# Altium schematic sheet power_supply.SchDoc: power supply
size 420 x 297 mm; SheetNumber: 6; SheetTotal: 8
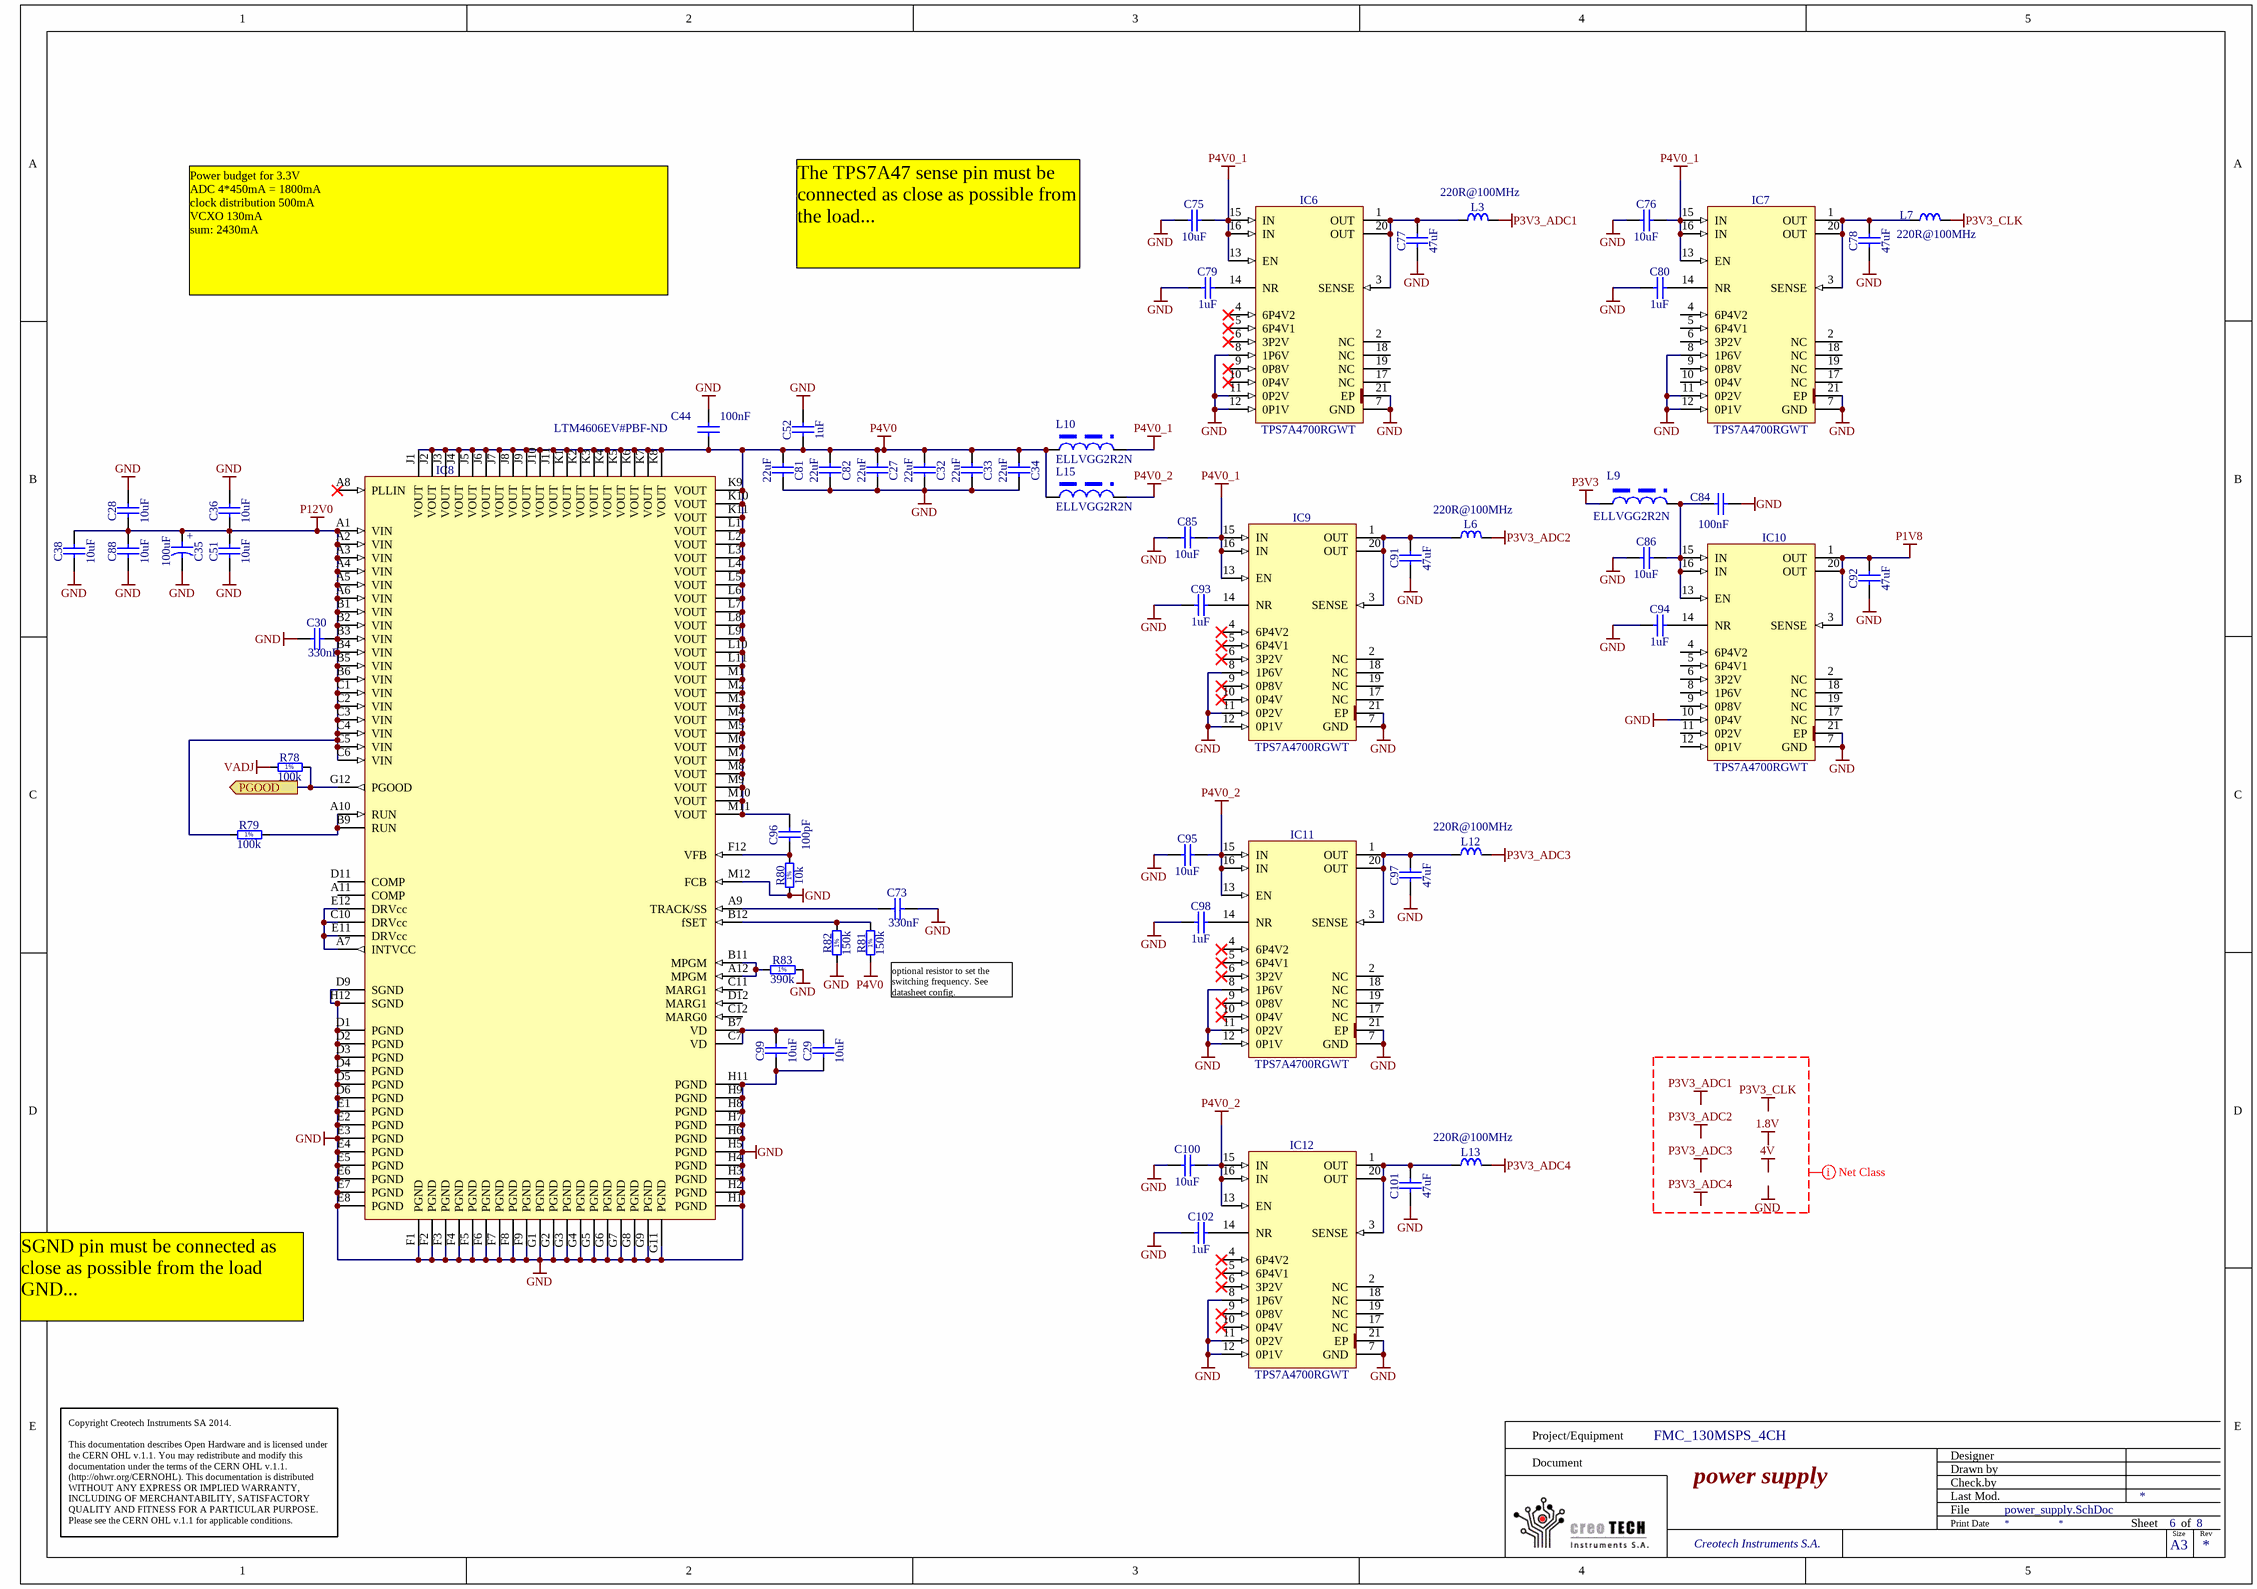
[diagram p0: power_supply.SchDoc]

## Parts
C27  22uF  [CAPC3216X140N]
C28  10uF  [CAPC2012X135N]
C29  10uF  [CAPC2012X135N]
C30  330nF  [CAPC1608X87N]
C32  22uF  [CAPC3216X140N]
C33  22uF  [CAPC3216X140N]
C34  22uF  [CAPC3216X140N]
C35  100uF  [CAPMP7343X310N]
C36  10uF  [CAPC2012X135N]
C38  10uF  [CAPC2012X135N]
C44  100nF  [CAPC0603X33N]
C51  10uF  [CAPC2012X135N]
C52  1uF  [CAPC1608X87N]
C73  330nF  [CAPC1608X87N]
C75  10uF  [CAPC2012X135N]
C76  10uF  [CAPC2012X135N]
C77  47uF  [CAPC2012X140N]
C78  47uF  [CAPC2012X140N]
C79  1uF  [CAPC1608X87N]
C80  1uF  [CAPC1608X87N]
C81  22uF  [CAPC3216X140N]
C82  22uF  [CAPC3216X140N]
C84  100nF  [CAPC0603X33N]
C85  10uF  [CAPC2012X135N]
C86  10uF  [CAPC2012X135N]
C88  10uF  [CAPC2012X135N]
C91  47uF  [CAPC2012X140N]
C92  47uF  [CAPC2012X140N]
C93  1uF  [CAPC1608X87N]
C94  1uF  [CAPC1608X87N]
C95  10uF  [CAPC2012X135N]
C96  100pF  [CAPC1005X55N]
C97  47uF  [CAPC2012X140N]
C98  1uF  [CAPC1608X87N]
C99  10uF  [CAPC2012X135N]
C100  10uF  [CAPC2012X135N]
C101  47uF  [CAPC2012X140N]
C102  1uF  [CAPC1608X87N]
IC6  TPS7A4700RGWT  [QFN65P500X500X100-21N-S325]
IC7  TPS7A4700RGWT  [QFN65P500X500X100-21N-S325]
IC8  LTM4606EV#PBF-ND  [LTM4606]
IC9  TPS7A4700RGWT  [QFN65P500X500X100-21N-S325]
IC10  TPS7A4700RGWT  [QFN65P500X500X100-21N-S325]
IC11  TPS7A4700RGWT  [QFN65P500X500X100-21N-S325]
IC12  TPS7A4700RGWT  [QFN65P500X500X100-21N-S325]
L3  220R@100MHz  [INDC2012X105N]
L6  220R@100MHz  [INDC2012X105N]
L7  220R@100MHz  [INDC2012X105N]
L9  ELLVGG2R2N  [L_ELLVGG2R2N]
L10  ELLVGG2R2N  [L_ELLVGG2R2N]
L12  220R@100MHz  [INDC2012X105N]
L13  220R@100MHz  [INDC2012X105N]
L15  ELLVGG2R2N  [L_ELLVGG2R2N]
R78  100k  [RESC1005X40N]
R79  100k  [RESC1005X40N]
R80  10k  [RESC1005X40N]
R81  150k  [RESC1005X40N]
R82  150k  [RESC1005X40N]
R83  390k  [RESC1005X40N]

## Ports
PGOOD (out)

## Nets
GND: C27.2 C28.2 C29.1 C30.1 C32.2 C33.2 C34.2 C35.2 C36.2 C38.1 C44.1 C51.1 C52.2 C73.2 C75.1 C76.1 C77.1 C78.1 C79.1 C80.1 C81.2 C82.2 C84.1 C85.1 C86.1 C88.1 C91.1 C92.1 C93.1 C94.1 C95.1 C97.1 C98.1 C99.1 C100.1 C101.1 C102.1 IC6.7(GND) IC6.8(1P6V) IC6.11(0P2V) IC6.12(0P1V) IC6.21(EP) IC7.7(GND) IC7.8(1P6V) IC7.11(0P2V) IC7.12(0P1V) IC7.21(EP) IC8.D1(PGND) IC8.D2(PGND) IC8.D3(PGND) IC8.D4(PGND) IC8.D5(PGND) IC8.D6(PGND) IC8.D9(SGND) IC8.E1(PGND) IC8.E2(PGND) IC8.E3(PGND) IC8.E4(PGND) IC8.E5(PGND) IC8.E6(PGND) IC8.E7(PGND) IC8.E8(PGND) IC8.F1(PGND) IC8.F2(PGND) IC8.F3(PGND) IC8.F4(PGND) IC8.F5(PGND) IC8.F6(PGND) IC8.F7(PGND) IC8.F8(PGND) IC8.F9(PGND) IC8.G1(PGND) IC8.G2(PGND) IC8.G3(PGND) IC8.G4(PGND) IC8.G5(PGND) IC8.G6(PGND) IC8.G7(PGND) IC8.G8(PGND) IC8.G9(PGND) IC8.G11(PGND) IC8.H1(PGND) IC8.H2(PGND) IC8.H3(PGND) IC8.H4(PGND) IC8.H5(PGND) IC8.H6(PGND) IC8.H7(PGND) IC8.H8(PGND) IC8.H9(PGND) IC8.H11(PGND) IC8.H12(SGND) IC8.M12(FCB) IC9.7(GND) IC9.8(1P6V) IC9.11(0P2V) IC9.12(0P1V) IC9.21(EP) IC10.7(GND) IC10.10(0P4V) IC10.21(EP) IC11.7(GND) IC11.8(1P6V) IC11.11(0P2V) IC11.12(0P1V) IC11.21(EP) IC12.7(GND) IC12.8(1P6V) IC12.11(0P2V) IC12.12(0P1V) IC12.21(EP) R80.2 R82.1 R83.2
P1V8: C92.2 IC10.1(OUT) IC10.3(SENSE) IC10.20(OUT)
P3V3: L9.1
P3V3_ADC1: L3.2
P3V3_ADC2: L6.2
P3V3_ADC3: L12.2
P3V3_ADC4: L13.2
P3V3_CLK: L7.2
P4V0: C27.1 C32.1 C33.1 C34.1 C44.2 C52.1 C81.1 C82.1 C96.2 IC8.J1(VOUT) IC8.J2(VOUT) IC8.J3(VOUT) IC8.J4(VOUT) IC8.J5(VOUT) IC8.J6(VOUT) IC8.J7(VOUT) IC8.J8(VOUT) IC8.J9(VOUT) IC8.J10(VOUT) IC8.J11(VOUT) IC8.K1(VOUT) IC8.K2(VOUT) IC8.K3(VOUT) IC8.K4(VOUT) IC8.K5(VOUT) IC8.K6(VOUT) IC8.K7(VOUT) IC8.K8(VOUT) IC8.K9(VOUT) IC8.K10(VOUT) IC8.K11(VOUT) IC8.L1(VOUT) IC8.L2(VOUT) IC8.L3(VOUT) IC8.L4(VOUT) IC8.L5(VOUT) IC8.L6(VOUT) IC8.L7(VOUT) IC8.L8(VOUT) IC8.L9(VOUT) IC8.L10(VOUT) IC8.L11(VOUT) IC8.M1(VOUT) IC8.M2(VOUT) IC8.M3(VOUT) IC8.M4(VOUT) IC8.M5(VOUT) IC8.M6(VOUT) IC8.M7(VOUT) IC8.M8(VOUT) IC8.M9(VOUT) IC8.M10(VOUT) IC8.M11(VOUT) L10.1 L15.1 R81.1
P4V0_1: C75.2 C76.2 C85.2 IC6.13(EN) IC6.15(IN) IC6.16(IN) IC7.13(EN) IC7.15(IN) IC7.16(IN) IC9.13(EN) IC9.15(IN) IC9.16(IN) L10.2
P4V0_2: C95.2 C100.2 IC11.13(EN) IC11.15(IN) IC11.16(IN) IC12.13(EN) IC12.15(IN) IC12.16(IN) L15.2
P12V0: C28.1 C30.2 C35.1 C36.1 C38.2 C51.2 C88.2 IC8.A1(VIN) IC8.A2(VIN) IC8.A3(VIN) IC8.A4(VIN) IC8.A5(VIN) IC8.A6(VIN) IC8.B1(VIN) IC8.B2(VIN) IC8.B3(VIN) IC8.B4(VIN) IC8.B5(VIN) IC8.B6(VIN) IC8.C1(VIN) IC8.C2(VIN) IC8.C3(VIN) IC8.C4(VIN) IC8.C5(VIN) IC8.C6(VIN) R79.1
VADJ: R78.1
PGOOD: IC8.G12(PGOOD) R78.2 ; port PGOOD
NetC29_2: C29.2 C99.2 IC8.B7(VD) IC8.C7(VD)
NetC73_1: C73.1 IC8.A9(TRACK/SS)
NetC77_2: C77.2 IC6.1(OUT) IC6.3(SENSE) IC6.20(OUT) L3.1
NetC78_2: C78.2 IC7.1(OUT) IC7.3(SENSE) IC7.20(OUT) L7.1
NetC79_2: C79.2 IC6.14(NR)
NetC80_2: C80.2 IC7.14(NR)
NetC84_2: C84.2 C86.2 IC10.13(EN) IC10.15(IN) IC10.16(IN) L9.2
NetC91_2: C91.2 IC9.1(OUT) IC9.3(SENSE) IC9.20(OUT) L6.1
NetC93_2: C93.2 IC9.14(NR)
NetC94_2: C94.2 IC10.14(NR)
NetC96_1: C96.1 IC8.F12(VFB) R80.1
NetC97_2: C97.2 IC11.1(OUT) IC11.3(SENSE) IC11.20(OUT) L12.1
NetC98_2: C98.2 IC11.14(NR)
NetC101_2: C101.2 IC12.1(OUT) IC12.3(SENSE) IC12.20(OUT) L13.1
NetC102_2: C102.2 IC12.14(NR)
NetIC8_A7: IC8.A7(INTVCC) IC8.C10(DRVcc) IC8.E11(DRVcc) IC8.E12(DRVcc)
NetIC8_A10: IC8.A10(RUN) IC8.B9(RUN) R79.2
NetIC8_A12: IC8.A12(MPGM) IC8.B11(MPGM) R83.1
NetIC8_B12: IC8.B12(fSET) R81.2 R82.2

Not connected (* = marked no-connect by the designer): IC6 2(NC) 4(6P4V2)* 5(6P4V1)* 6(3P2V)* 9(0P8V)* 10(0P4V)* 17(NC) 18(NC) 19(NC); IC7 2(NC) 4(6P4V2) 5(6P4V1) 6(3P2V) 9(0P8V) 10(0P4V) 17(NC) 18(NC) 19(NC); IC8 A8(PLLIN)* A11(COMP) C11(MARG1) C12(MARG0) D11(COMP) D12(MARG1) J12(NC) K12(NC) L12(NC); IC9 2(NC) 4(6P4V2)* 5(6P4V1)* 6(3P2V)* 9(0P8V)* 10(0P4V)* 17(NC) 18(NC) 19(NC); IC10 2(NC) 4(6P4V2) 5(6P4V1) 6(3P2V) 8(1P6V) 9(0P8V) 11(0P2V) 12(0P1V) 17(NC) 18(NC) 19(NC); IC11 2(NC) 4(6P4V2)* 5(6P4V1)* 6(3P2V)* 9(0P8V)* 10(0P4V)* 17(NC) 18(NC) 19(NC); IC12 2(NC) 4(6P4V2)* 5(6P4V1)* 6(3P2V)* 9(0P8V)* 10(0P4V)* 17(NC) 18(NC) 19(NC)

## Layout directives
net class Power: 1.8V, 4V, GND, P3V3_ADC1, P3V3_ADC2, P3V3_ADC3, P3V3_ADC4, P3V3_CLK

## Notes on the sheet
- The TPS7A47 sense pin must be connected as close as possible from the load...
- Power budget for 3.3V
  ADC 4*450mA = 1800mA
  clock distribution 500mA
  VCXO 130mA
  sum: 2430mA
- (near R81) optional resistor to set the switching frequency. See datasheet config.
- SGND pin must be connected as close as possible from the load GND...
- Labels drawn without touching a wire or pin: 1.8V, 4V, GND, P3V3_ADC1, P3V3_ADC2, P3V3_ADC3, P3V3_ADC4, P3V3_CLK
- Project/Equipment
- Document
- FMC_130MSPS_4CH
- Designer
- Drawn by
- Check.by
- Copyright Creotech Instruments SA 2014.
  This documentation describes Open Hardware and is licensed under the CERN OHL v.1.1. You may redistribute and modify this documentation under the terms of the CERN OHL v.1.1. (http://ohwr.org/CERNOHL). This documentation is distributed WITHOUT ANY EXPRESS OR IMPLIED WARRANTY, INCLUDING OF MERCHANTABILITY, SATISFACTORY QUALITY AND FITNESS FOR A PARTICULAR PURPOSE. Please see the CERN OHL v.1.1 for applicable conditions.
- Creotech Instruments S.A.
- File
- Last Mod.
- Print Date
- Sheet
- Size
- A3
- of
- Rev
- (in symbol CTE7343-31_100UF_20V_10%) +
- (in symbol R0402_10K_1%_0.0625W_100PPM) 1%
- (in symbol R0402_100K_1%_0.0625W_100PPM) 1%
- (in symbol R0402_150K_1%_0.0625W_100PPM) 1%
- (in symbol R0402_390K_1%_0.0625W_100PPM) 1%

## Library data of the parts
C27 C32-C34 C81 C82 = CC1206_22UF_6.3V_20%_X5R: Non-polarised capacitor; Part Description: SMD Multilayer Chip Ceramic Capacitor; Manufacturer: GENERIC; Manufacturer1 Part Number: C1206C226K9PAC; Voltage: 6.3V; TC: X5R; Tolerance: ±20%; Table: Capacitors SMD; Part Number: CC1206_22UF_6.3V_20%_X5R; Component Kind: Standard; Component Type: Standard; Pin Count: 2; Value: 22uF; Status: Preferred; Manufacturer Part Number: CC1206_22UF_6.3V_20%_X5R; Case: 1206; Mounted: Yes; Socket: No; SMD: Yes; Manufacturer1 Example: KEMET; Manufacturer1 ComponentHeight: 1.8mm; HelpURL: \\cern.ch\dfs\Applications\Altium\Datasheets\CC1206_X5R_KEMET.pdf; Author: CERN DEM JLC; CreateDate: 3/12/2007; LatestRevisionDate: 3/12/2007
C28 C29 C36 C38 C51 C88 C99 = CC0805_10UF_16V_10%_X5R: Non-polarised capacitor; Part Description: SMD Multilayer Chip Ceramic Capacitor; Manufacturer: GENERIC; Manufacturer1 Part Number: C0805C106K4PAC; Voltage: 16V; TC: X5R; Tolerance: ±10%; Table: Capacitors SMD; Part Number: CC0805_10UF_16V_10%_X5R; Component Kind: Standard; Component Type: Standard; Pin Count: 2; Value: 10uF; Status: Preferred; Manufacturer Part Number: CC0805_10UF_16V_10%_X5R; Case: 0805; Mounted: Yes; Socket: No; SMD: Yes; Manufacturer1 Example: KEMET; Manufacturer1 ComponentHeight: 1.4mm; HelpURL: \\cern.ch\dfs\Applications\Altium\Datasheets\CC1206_X5R_KEMET.pdf; Author: CERN DEM JLC; CreateDate: 3/12/2007; LatestRevisionDate: 3/12/2007
C30 C73 = CC0603_330NF_16V_10%_X5R: Non-polarised capacitor; Part Description: SMD Multilayer Chip Ceramic Capacitor; Manufacturer: GENERIC; Manufacturer1 Part Number: 223878613656; Voltage: 16V; TC: X5R; Tolerance: ±10%; Table: Capacitors SMD; Part Number: CC0603_330NF_16V_10%_X5R; Component Kind: Standard; Component Type: Standard; Pin Count: 2; Value: 330nF; Status: Preferred; Manufacturer Part Number: CC0603_330NF_16V_10%_X5R; Case: 0603; Mounted: Yes; Socket: No; SMD: Yes; Manufacturer1 Example: PHYCOMP; Manufacturer1 ComponentHeight: 0.87mm; HelpURL: \\cern.ch\dfs\Applications\Altium\Datasheets\CC0805_X5R_PHYCOMP_HC.pdf; Author: CERN DEM JLC; CreateDate: 3/12/2007; LatestRevisionDate: 3/12/2007
C35 = CTE7343-31_100UF_20V_10%: Polarised capacitor; Part Description: Solid Tantalum Chip Capacitor; Manufacturer: GENERIC; Manufacturer1 Part Number: TAJD107K020R; Voltage: 20V; Tolerance: ±10%; Table: Capacitors SMD; Part Number: CTE7343-31_100UF_20V_10%; Component Kind: Standard; Component Type: Standard; Pin Count: 2; Value: 100uF; Status: Preferred; Manufacturer Part Number: CTE7343-31_100UF_20V_10%; Case: D; Mounted: Yes; Socket: No; SMD: Yes; Manufacturer1 Example: AVX; Manufacturer1 ComponentHeight: 3.1mm; HelpURL: \\cern.ch\dfs\Applications\Altium\Datasheets\CTE_AVX_TAJ.pdf; Author: CERN DEM JLC; CreateDate: 3/12/2007; LatestRevisionDate: 3/12/2007
C44 C84 = CC0201_100NF_6.3V_10%_X5R: Non-polarised capacitor; Part Description: SMD Multilayer Chip Ceramic Capacitor; Manufacturer: GENERIC; Manufacturer1 Part Number: 02016D104KAT2A; Voltage: 6.3V; TC: X5R; Tolerance: ±10%; Table: Capacitors SMD; Part Number: CC0201_100NF_6.3V_10%_X5R; Component Kind: Standard; Component Type: Standard; Pin Count: 2; Value: 100nF; Status: Not Recommended; Manufacturer Part Number: CC0201_100NF_6.3V_10%_X5R; Case: 0201; Mounted: Yes; Socket: No; SMD: Yes; Manufacturer1 Example: AVX; Manufacturer1 ComponentHeight: 0.33mm; HelpURL: \\cern.ch\dfs\Applications\Altium\Datasheets\CC0201_X5R_AVX.pdf; Author: CERN DEM JLC; CreateDate: 2007-12-03; LatestRevisionDate: 2007-12-03
C52 C79 C80 C93 C94 C98 C102 = CC0603_1UF_25V_10%_X7R: Non-polarised capacitor; Part Description: SMD Multilayer Chip Ceramic Capacitor; Manufacturer: GENERIC; Manufacturer1 Part Number: GRM188R71E105KA12D; Voltage: 25V; TC: X7R; Tolerance: ±10%; Table: Capacitors SMD; Part Number: CC0603_1UF_25V_10%_X7R; Component Kind: Standard; Component Type: Standard; Pin Count: 2; Value: 1uF; Status: None; Manufacturer Part Number: CC0603_1UF_25V_10%_X7R; Case: 0603; Mounted: Yes; Socket: No; SMD: Yes; Manufacturer1 Example: MURATA; Manufacturer1 ComponentHeight: 0.9mm; HelpURL: \\cern.ch\dfs\Applications\Altium\Datasheets\CC0603_X7R_MURATA.pdf; Author: CERN DEM JLC; CreateDate: 18/1/2011; LatestRevisionDate: 18/1/2011
C75 C76 C85 C86 C95 C100 = CC0805_10UF_10V_10%_X7R: Non-polarised capacitor; Part Description: SMD Multilayer Chip Ceramic Capacitor; Manufacturer: GENERIC; Manufacturer1 Part Number: GRM21BR71A106KE51L; Voltage: 10V; TC: X7R; Tolerance: ±10%; Table: Capacitors SMD; Part Number: CC0805_10UF_10V_10%_X7R; Component Kind: Standard; Component Type: Standard; Pin Count: 2; Value: 10uF; Status: Preferred; Manufacturer Part Number: CC0805_10UF_10V_10%_X7R; Case: 0805; Mounted: Yes; Socket: No; SMD: Yes; Manufacturer1 Example: MURATA; Manufacturer1 ComponentHeight: 1.35mm; HelpURL: \\cern.ch\dfs\Applications\Altium\Datasheets\CC0805_X7R_MURATA.pdf; Author: CERN DEM JLC; CreateDate: 30/4/2012; LatestRevisionDate: 30/4/2012
C77 C78 C91 C92 C97 C101 = CC0805_47UF_6.3V_20%_X5R: Non-polarised capacitor; Part Description: SMD Multilayer Chip Ceramic Capacitor; Manufacturer: GENERIC; Manufacturer1 Part Number: C0805C476M9PACTU; Voltage: 6.3V; TC: X5R; Tolerance: ±20%; Table: Capacitors SMD; Part Number: CC0805_47UF_6.3V_20%_X5R; Component Kind: Standard; Component Type: Standard; Pin Count: 2; Value: 47uF; Status: Preferred; Manufacturer Part Number: CC0805_47UF_6.3V_20%_X5R; Case: 0805; Mounted: Yes; Socket: No; SMD: Yes; Manufacturer1 Example: KEMET; Manufacturer1 ComponentHeight: 1.4mm; HelpURL: \\cern.ch\dfs\Applications\Altium\Datasheets\CC0805_X5R_KEMET.pdf; Author: CERN DEM JLC; CreateDate: 16/10/2012; LatestRevisionDate: 16/10/2012
C96 = CC0402_100PF_50V_5%_NP0: Non-polarised capacitor; Part Description: SMD Multilayer Chip Ceramic Capacitor; Manufacturer: GENERIC; Manufacturer1 Part Number: 223886915101; Voltage: 50V; TC: NP0; Tolerance: ±5%; Table: Capacitors SMD; Part Number: CC0402_100PF_50V_5%_NP0; Component Kind: Standard; Component Type: Standard; Pin Count: 2; Value: 100pF; Status: Not Recommended; Manufacturer Part Number: CC0402_100PF_50V_5%_NP0; Case: 0402; Mounted: Yes; Socket: No; SMD: Yes; Manufacturer1 Example: PHYCOMP; Manufacturer1 ComponentHeight: 0.55mm; HelpURL: \\cern.ch\dfs\Applications\Altium\Datasheets\CC0402_NP0_PHYCOMP.pdf; Author: CERN DEM JLC; CreateDate: 3/12/2007; LatestRevisionDate: 3/12/2007
IC6 IC7 IC9-IC12 = TPS7A4700RGWT: Low Noise (3uVrms), 1A, High Voltage Low-Dropout Linear Regulator; Part Description: 1.4 V to 19.1 V, 1A, Low Noise (3uVrms), Low-Dropout Linear Regulator; Manufacturer: TEXAS INSTRUMENTS; Table: Regulators; Part Number: TPS7A4700RGWT; Component Kind: Standard; Component Type: Standard; Device: TPS7A4700RGWT; PackageDescription: QFN, 0.65mm pitch,square; 20 pin, 5mm X 5mm X 1mm H body (w/thermal tab 3.25 X 3.25mm),  IPC Medium Density; Manufacturer Part Number: TPS7A4700RGWT; Pin Count: 21; Case: QFN20; Mounted: Yes; Socket: No; SMD: Yes; ComponentHeight: 1mm; HelpURL: \\cern.ch\dfs\Applications\Altium\Datasheets\TPS7A4700RGWT.pdf; Author: CERN DEM JLC; CreateDate: 3/7/2012; LatestRevisionDate: 3/7/2012
  IC6: Footprint: QFN65P500X500X100-21N-S325_mod
IC8 = LTM4601: 4.5V-20V To 0.6V-5V, Iout 6A DC/DC low EMI uModule; Supplier 1: Digi-Key; Supplier Part Number 1: LTM4606EV#PBF-ND
L3 L6 L7 L12 L13 = IND0805_MURATA_BLM21PG221SN1D: Inductor; Part Description: SMD EMIFIL Suppression Chip Ferrite Bead; Manufacturer: MURATA; Power: 2A; Resistance: 0.05R; Tolerance: ±25%; Table: Inductors SMD; Part Number: IND0805_MURATA_BLM21PG221SN1D; Component Kind: Standard; Component Type: Standard; Pin Count: 2; Value: 220R@100MHz; Status: None; Manufacturer Part Number: BLM21PG221SN1D; Case: 0805; Mounted: Yes; Socket: No; SMD: Yes; ComponentHeight: 1.05mm; HelpURL: \\cern.ch\dfs\Applications\Altium\Datasheets\IND0402_MURATA_BLM21P.pdf; Author: CERN DEM JLC; CreateDate: 25/1/2010; LatestRevisionDate: 25/1/2010
L9 L10 L15 = L_CHOKE_ELLVGG: 2.2uH, 1.4A, 92mR Panasonic
R78 R79 = R0402_100K_1%_0.0625W_100PPM: Resistor - 1%; Part Description: General Purpose Thick Film Chip Resistor; Manufacturer: GENERIC; Manufacturer1 Part Number: 232270671004L; TC: ±100ppm/°C; Table: Resistors SMD; Part Number: R0402_100K_1%_0.0625W_100PPM; Component Kind: Standard; Component Type: Standard; Pin Count: 2; Value: 100k; Status: Not recommended; Power: 0.0625W; Tolerance: ±1%; Manufacturer Part Number: R0402_100K_1%_0.0625W_100PPM; Case: 0402; Mounted: Yes; Socket: No; SMD: Yes; Manufacturer1 Example: YAGEO PHYCOMP; Manufacturer1 ComponentHeight: 0.4mm; HelpURL: \\cern.ch\dfs\Applications\Altium\Datasheets\R0402_Phycomp_RC0402.pdf; Author: CERN DEM JLC; CreateDate: 3/12/2007; LatestRevisionDate: 17/10/2012
R80 = R0402_10K_1%_0.0625W_100PPM: Resistor - 1%; Part Description: General Purpose Thick Film Chip Resistor; Manufacturer: GENERIC; Manufacturer1 Part Number: 232270671003L; TC: ±100ppm/°C; Table: Resistors SMD; Part Number: R0402_10K_1%_0.0625W_100PPM; Component Kind: Standard; Component Type: Standard; Pin Count: 2; Value: 10k; Status: Not recommended; Power: 0.0625W; Tolerance: ±1%; Manufacturer Part Number: R0402_10K_1%_0.0625W_100PPM; Case: 0402; Mounted: Yes; Socket: No; SMD: Yes; Manufacturer1 Example: YAGEO PHYCOMP; Manufacturer1 ComponentHeight: 0.4mm; HelpURL: \\cern.ch\dfs\Applications\Altium\Datasheets\R0402_Phycomp_RC0402.pdf; Author: CERN DEM JLC; CreateDate: 3/12/2007; LatestRevisionDate: 17/10/2012
R81 R82 = R0402_150K_1%_0.0625W_100PPM: Resistor - 1%; Part Description: General Purpose Thick Film Chip Resistor; Manufacturer: GENERIC; Manufacturer1 Part Number: 232270671504L; TC: ±100ppm/°C; Table: Resistors SMD; Part Number: R0402_150K_1%_0.0625W_100PPM; Component Kind: Standard; Component Type: Standard; Pin Count: 2; Value: 150k; Status: Not recommended; Power: 0.0625W; Tolerance: ±1%; Manufacturer Part Number: R0402_150K_1%_0.0625W_100PPM; Case: 0402; Mounted: Yes; Socket: No; SMD: Yes; Manufacturer1 Example: YAGEO PHYCOMP; Manufacturer1 ComponentHeight: 0.4mm; HelpURL: \\cern.ch\dfs\Applications\Altium\Datasheets\R0402_Phycomp_RC0402.pdf; Author: CERN DEM JLC; CreateDate: 3/12/2007; LatestRevisionDate: 17/10/2012
R83 = R0402_390K_1%_0.0625W_100PPM: Resistor - 1%; Part Description: General Purpose Thick Film Chip Resistor; Manufacturer: GENERIC; Manufacturer1 Part Number: 232270673904L; TC: ±100ppm/°C; Table: Resistors SMD; Part Number: R0402_390K_1%_0.0625W_100PPM; Component Kind: Standard; Component Type: Standard; Pin Count: 2; Value: 390k; Status: Not recommended; Power: 0.0625W; Tolerance: ±1%; Manufacturer Part Number: R0402_390K_1%_0.0625W_100PPM; Case: 0402; Mounted: Yes; Socket: No; SMD: Yes; Manufacturer1 Example: YAGEO PHYCOMP; Manufacturer1 ComponentHeight: 0.4mm; HelpURL: \\cern.ch\dfs\Applications\Altium\Datasheets\R0402_Phycomp_RC0402.pdf; Author: CERN DEM JLC; CreateDate: 3/12/2007; LatestRevisionDate: 17/10/2012